# EAGLE design DRV_RGB (EAGLE 6.4)
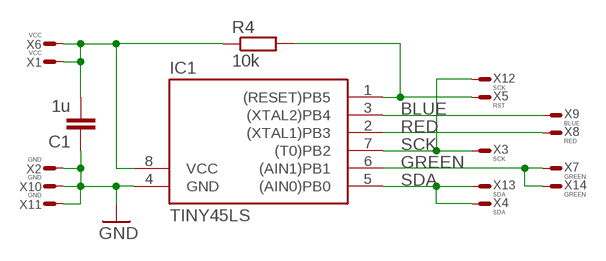
[diagram p0: schematic, sheet 1]

## Parts
C1  1u  C0603  [0603]
IC1  TINY45LS  TINY11LS  [SOIC8]
R4  10k  R0603  [0603]
X1  VCC  WIREPADT1.6/0.9  [T1.6/0.9]
X2  GND  WIREPADT1.6/0.9  [T1.6/0.9]
X3  SCK  WIREPADT1.6/0.9  [T1.6/0.9]
X4  SDA  WIREPADT1.6/0.9  [T1.6/0.9]
X5  RST  WIREPADT1.6/0.9  [T1.6/0.9]
X6  VCC  WIREPADT1.6/0.9  [T1.6/0.9]
X7  GREEN  WIREPADT1.6/0.9  [T1.6/0.9]
X8  RED  WIREPADT1.6/0.9  [T1.6/0.9]
X9  BLUE  WIREPADT1.6/0.9  [T1.6/0.9]
X10  GND  WIREPADT1.6/0.9  [T1.6/0.9]
X11  GND  WIREPADT1.6/0.9  [T1.6/0.9]
X12  SCK  WIREPADT1.6/0.9  [T1.6/0.9]
X13  SDA  WIREPADT1.6/0.9  [T1.6/0.9]
X14  GREEN  WIREPADT1.6/0.9  [T1.6/0.9]

## Nets
BLUE: IC1.3((XTAL2)PB4) X9.1(S)
GND: C1.1 IC1.4(GND) X2.1(S) X10.1(S) X11.1(S)
GREEN: IC1.6((AIN1)PB1) X7.1(S) X14.1(S)
N$1: C1.2 IC1.8(VCC) R4.1 X1.1(S) X6.1(S)
N$7: IC1.1((RESET)PB5) R4.2 X5.1(S)
RED: IC1.2((XTAL1)PB3) X8.1(S)
SCK: IC1.7((T0)PB2) X3.1(S) X12.1(S)
SDA: IC1.5((AIN0)PB0) X4.1(S) X13.1(S)

## Library data of the parts
C1 = RCL:C: Capacitor SMD
IC1 = atmel:TINY11*: MICROCONTROLLER 1 Kbytes FLASH
R4 = RCL:R: Resistor SMD
X1-X14 = Conn:WIREPAD: Wire PAD connect wire on PCB

## Board
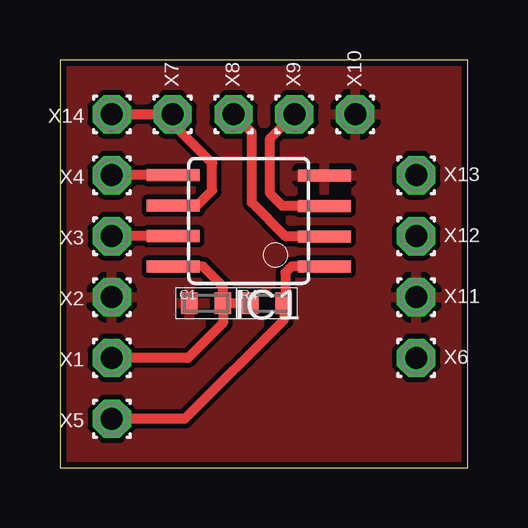
[diagram p1: board, top side]
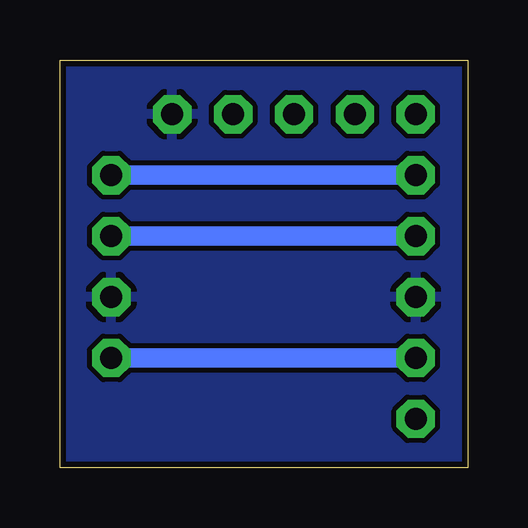
[diagram p2: board, bottom side, seen from below]

Size 17 x 17 mm. Coordinates in mm from the lower left corner, seen from the top.
Outline: 0,0 17,0 17,17 0,17 0,0
Copper layers (1*16): Top 0.035mm / dielectric 1.5mm / Bottom 0.035mm
Design rules "default *": minimum track width 10mil, minimum drill 24mil, track to track 8mil, track to pad 8mil, pad to pad 8mil, via to via 8mil, smd to smd 8mil, copper to edge 10mil, drill to drill 8mil, minimum pad ring 10mil, minimum via ring 8mil, stop-mask expansion 4mil, vias tented up to drill 0mil, thermal gap 10mil

### Footprints (pad centres in the part's own frame; a part is rotated, then mirrored left to right if it is on the bottom)
0603 = smd 0.7 x 0.9: 1 -0.697,0; 2 0.697,0
SOIC8 = smd 0.5 x 2.2: 1 -1.905,-3.154; 2 -0.645,-3.154; 3 0.625,-3.154; 4 1.895,-3.154; 5 1.905,3.154; 6 0.635,3.154; 7 -0.635,3.154; 8 -1.905,3.154
T1.6/0.9 = drill 0.914 pad 1.6 octagon: 1 0,0

### Placement (x,y rotation side)
C1  6.1,6.86 0 top
IC1  7.87,10.29 90 top
R4  8.64,6.86 0 top
X1  2.16,4.57 180 top
X2  2.16,7.11 180 top
X3  2.16,9.65 180 top
X4  2.16,12.19 180 top
X5  2.16,2.03 180 top
X6  14.86,4.57 0 top
X7  4.7,14.73 90 top
X8  7.24,14.73 90 top
X9  9.78,14.73 90 top
X10  12.32,14.73 90 top
X11  14.86,7.11 0 top
X12  14.86,9.65 0 top
X13  14.86,12.19 0 top
X14  2.16,14.73 180 top

### Tracks (layer width: path | path; a pad name or v marks a point on that pad's centre or on a via)
BLUE
  Top 0.406: IC1.3 9.28,10.91 8.76,11.43 8.76,13.72 X9.1
GND
  pour Bottom: 0,0 17.02,0 17.02,16.99 0,16.99
  pour Top: 0,0 17.02,0 17.02,16.99 0,16.99
GREEN
  Top 0.406: IC1.6 5.71,10.92 6.35,11.56 6.35,12.7 4.7,14.35 X7.1 X14.1
N$1
  Top 0.406: C1.2 6.79,6.03 5.33,4.57 X1.1 | C1.2 6.79,7.56 5.97,8.38 IC1.8 | C1.2 R4.1
  Bottom 0.813: X6.1 X1.1
N$7
  Top 0.406: IC1.1 9.65,8.38 9.4,8.13 9.4,6.92 R4.2 9.33,6.16 5.21,2.03 X5.1
RED
  Top 0.406: IC1.2 9.41,9.64 8,11.05 8,13.97 X8.1
SCK
  Top 0.406: IC1.7 X3.1
  Bottom 0.813: X3.1 X12.1
SDA
  Top 0.406: IC1.5 X4.1
  Bottom 0.813: X4.1 X13.1